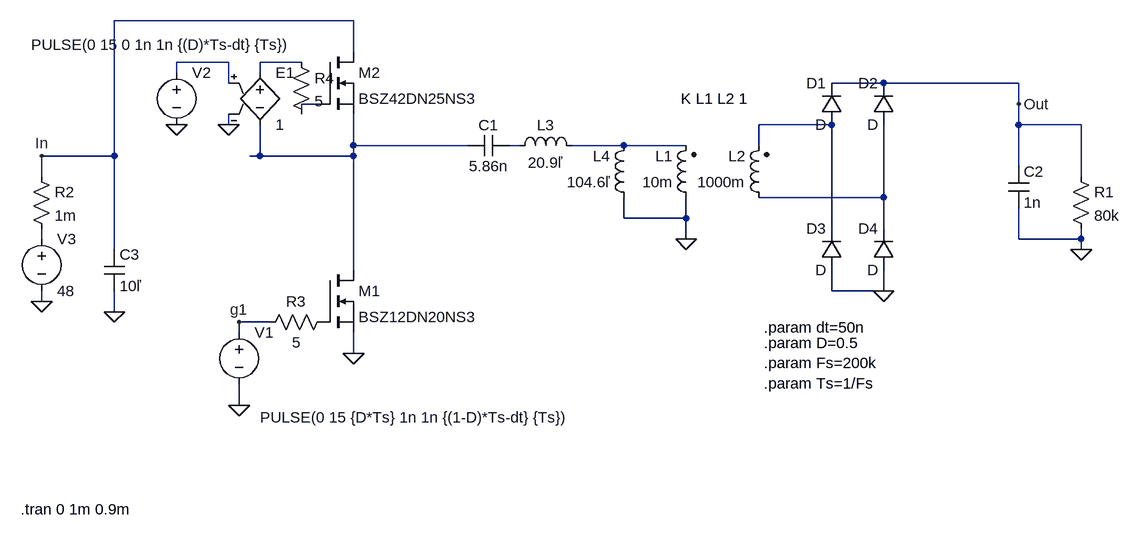
[diagram p0: schematic LLCv1.asc]
LLCv1.asc, the LTspice schematic file:
Version 4
SHEET 1 1576 680
WIRE -80 -320 -448 -320
WIRE -80 -272 -80 -320
WIRE -272 -256 -352 -256
WIRE -160 -256 -224 -256
WIRE -352 -240 -352 -256
WIRE -224 -240 -224 -256
WIRE -272 -224 -272 -256
WIRE 736 -224 656 -224
WIRE 944 -224 736 -224
WIRE -128 -192 -160 -192
WIRE 944 -192 944 -224
WIRE -160 -176 -160 -192
WIRE -272 -160 -272 -176
WIRE 656 -160 544 -160
WIRE 944 -160 944 -192
WIRE 1040 -160 944 -160
WIRE -80 -128 -80 -176
WIRE 96 -128 -80 -128
WIRE 176 -128 160 -128
WIRE 336 -128 256 -128
WIRE 432 -128 336 -128
WIRE 544 -128 544 -160
WIRE -448 -112 -448 -320
WIRE -448 -112 -560 -112
WIRE -224 -112 -224 -160
WIRE -224 -112 -240 -112
WIRE -80 -112 -80 -128
WIRE -80 -112 -224 -112
WIRE 944 -96 944 -160
WIRE -560 -80 -560 -112
WIRE 1040 -80 1040 -160
WIRE 736 -48 736 -160
WIRE 736 -48 544 -48
WIRE 336 -16 336 -48
WIRE 432 -16 432 -48
WIRE 432 -16 336 -16
WIRE 656 0 656 -160
WIRE 736 0 736 -48
WIRE -560 16 -560 0
WIRE 432 16 432 -16
WIRE 944 16 944 -32
WIRE 1040 16 1040 0
WIRE 1040 16 944 16
WIRE -448 32 -448 -112
WIRE 1040 32 1040 16
WIRE -80 64 -80 -112
WIRE 656 96 656 64
WIRE 736 96 736 64
WIRE 736 96 656 96
WIRE -560 112 -560 96
WIRE -448 128 -448 96
WIRE -208 144 -256 144
WIRE -256 160 -256 144
WIRE -80 192 -80 160
WIRE -256 272 -256 240
FLAG -256 272 0
FLAG 1040 32 0
FLAG 944 -192 Out
FLAG -560 -112 In
FLAG -560 112 0
FLAG -448 128 0
FLAG -256 144 g1
FLAG -80 192 0
FLAG -352 -160 0
FLAG -272 -160 0
FLAG 432 16 0
FLAG 736 96 0
SYMBOL nmos -128 64 R0
SYMATTR InstName M1
SYMATTR Value BSZ12DN20NS3
SYMBOL voltage -256 144 R0
WINDOW 3 32 147 Left 2
WINDOW 123 0 0 Left 0
WINDOW 39 0 0 Left 0
SYMATTR Value PULSE(0 15 {D*Ts} 1n 1n {(1-D)*Ts-dt} {Ts})
SYMATTR InstName V1
SYMBOL ind2 448 -32 R180
WINDOW 0 36 80 Left 2
WINDOW 3 36 40 Left 2
SYMATTR InstName L1
SYMATTR Value 10m
SYMATTR Type ind
SYMBOL ind2 560 -32 R180
WINDOW 0 36 80 Left 2
WINDOW 3 36 40 Left 2
SYMATTR InstName L2
SYMATTR Value 1000m
SYMATTR Type ind
SYMBOL res 1024 -96 R0
SYMATTR InstName R1
SYMATTR Value 80k
SYMBOL voltage -560 0 R0
SYMATTR InstName V3
SYMATTR Value 48
SYMBOL res -576 -96 R0
SYMATTR InstName R2
SYMATTR Value 1m
SYMBOL cap -464 32 R0
SYMATTR InstName C3
SYMATTR Value 10ľ
SYMBOL ind 352 -32 R180
WINDOW 0 36 80 Left 2
WINDOW 3 36 40 Left 2
SYMATTR InstName L4
SYMATTR Value 104.6ľ
SYMBOL nmos -128 -272 R0
SYMATTR InstName M2
SYMATTR Value BSZ42DN25NS3
SYMBOL voltage -352 -256 R0
WINDOW 3 -224 -27 Left 2
WINDOW 123 0 0 Left 0
WINDOW 39 0 0 Left 0
SYMATTR Value PULSE(0 15 0 1n 1n {(D)*Ts-dt} {Ts})
SYMATTR InstName V2
SYMBOL e -224 -256 R0
SYMATTR InstName E1
SYMATTR Value 1
SYMBOL cap 160 -144 R90
WINDOW 0 0 32 VBottom 2
WINDOW 3 32 32 VTop 2
SYMATTR InstName C1
SYMATTR Value 5.86n
SYMBOL ind 160 -112 R270
WINDOW 0 32 56 VTop 2
WINDOW 3 5 56 VBottom 2
SYMATTR InstName L3
SYMATTR Value 20.9ľ
SYMBOL diode 672 -160 R180
WINDOW 0 24 64 Left 2
WINDOW 3 24 0 Left 2
SYMATTR InstName D1
SYMBOL diode 752 -160 R180
WINDOW 0 24 64 Left 2
WINDOW 3 24 0 Left 2
SYMATTR InstName D2
SYMBOL diode 672 64 R180
WINDOW 0 24 64 Left 2
WINDOW 3 24 0 Left 2
SYMATTR InstName D3
SYMBOL diode 752 64 R180
WINDOW 0 24 64 Left 2
WINDOW 3 24 0 Left 2
SYMATTR InstName D4
SYMBOL cap 928 -96 R0
SYMATTR InstName C2
SYMATTR Value 1n
SYMBOL res -112 128 R90
WINDOW 0 0 56 VBottom 2
WINDOW 3 32 56 VTop 2
SYMATTR InstName R3
SYMATTR Value 5
SYMBOL res -176 -272 R0
SYMATTR InstName R4
SYMATTR Value 5
TEXT 552 176 Left 2 !.param D=0.5\n.param Fs=200k\n.param Ts=1/Fs
TEXT 424 -200 Left 2 !K L1 L2 1
TEXT -592 432 Left 2 !.tran 0 1m 0.9m
TEXT 552 152 Left 2 !.param dt=50n

The netlist it stands for:
* LLCv1.asc
M1 N005 P001 0 0 BSZ12DN20NS3
V1 g1 0 PULSE(0 15 {D*Ts} 1n 1n {(1-D)*Ts-dt} {Ts})
L1 0 N007 10m
L2 N008 N004 1000m
R1 Out 0 80k
V3 N009 0 48
R2 In N009 1m
C3 In 0 10ľ
L4 0 N007 104.6ľ
M2 In N003 N005 N005 BSZ42DN25NS3
V2 N001 0 PULSE(0 15 0 1n 1n {(D)*Ts-dt} {Ts})
E1 N002 N005 N001 0 1
C1 N006 N005 5.86n
L3 N006 N007 20.9ľ
D1 N004 Out D
D2 N008 Out D
D3 0 N004 D
D4 0 N008 D
C2 Out 0 1n
R3 P001 g1 5
R4 N002 N003 5
.model D D
.lib standard.dio
.model NMOS NMOS
.model PMOS PMOS
.lib standard.mos
.param D=0.5
.param Fs=200k
.param Ts=1/Fs
K L1 L2 1
.tran 0 1m 0.9m
.param dt=50n
.backanno
.end